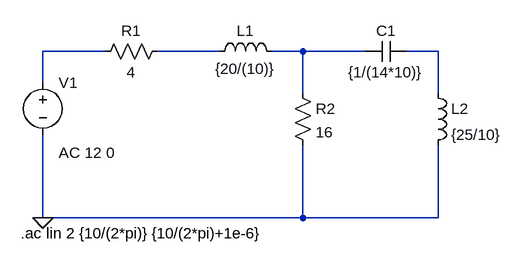
[diagram p0: schematic Simulacion Tarea 8.asc]
Simulacion Tarea 8.asc, the LTspice schematic file:
Version 4
SHEET 1 880 680
WIRE 96 96 0 96
WIRE 272 96 176 96
WIRE 400 96 352 96
WIRE 496 96 400 96
WIRE 608 96 560 96
WIRE 0 144 0 96
WIRE 400 160 400 96
WIRE 608 160 608 96
WIRE 0 352 0 224
WIRE 400 352 400 240
WIRE 400 352 0 352
WIRE 608 352 608 240
WIRE 608 352 400 352
FLAG 0 352 0
SYMBOL voltage 0 128 R0
WINDOW 123 24 124 Left 2
WINDOW 39 0 0 Left 0
SYMATTR InstName V1
SYMATTR Value ""
SYMATTR Value2 AC 12 0
SYMBOL res 80 112 R270
WINDOW 0 32 56 VTop 2
WINDOW 3 0 56 VBottom 2
SYMATTR InstName R1
SYMATTR Value 4
SYMBOL ind 256 112 R270
WINDOW 0 32 56 VTop 2
WINDOW 3 5 56 VBottom 2
SYMATTR InstName L1
SYMATTR Value {20/(10)}
SYMBOL res 384 144 R0
SYMATTR InstName R2
SYMATTR Value 16
SYMBOL cap 560 80 R90
WINDOW 0 0 32 VBottom 2
WINDOW 3 32 32 VTop 2
SYMATTR InstName C1
SYMATTR Value {1/(14*10)}
SYMBOL ind 592 144 R0
SYMATTR InstName L2
SYMATTR Value {25/10}
TEXT -34 376 Left 2 !.ac lin 2 {10/(2*pi)} {10/(2*pi)+1e-6}

The netlist it stands for:
* Simulacion Tarea 8.asc
V1 N001 0 AC 12 0
R1 N001 N002 4
L1 N002 N003 {20/(10)}
R2 N003 0 16
C1 N004 N003 {1/(14*10)}
L2 N004 0 {25/10}
.ac lin 2 {10/(2*pi)} {10/(2*pi)+1e-6}
.backanno
.end